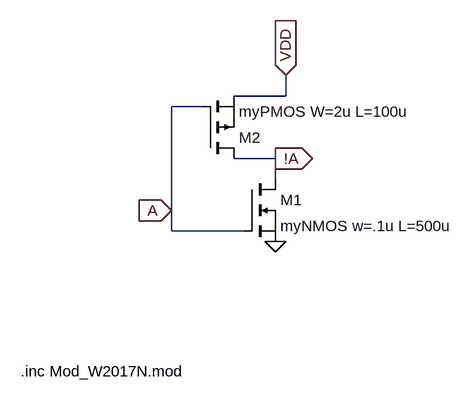
[diagram p0: schematic Gate_NOT_Slow.asc]
Gate_NOT_Slow.asc, the LTspice schematic file:
Version 4
SHEET 1 880 680
WIRE 64 -112 64 -144
WIRE 64 -112 -16 -112
WIRE -64 -96 -112 -96
WIRE 48 -16 -16 -16
WIRE 48 16 48 -16
WIRE -112 64 -112 -96
WIRE -112 96 -112 64
WIRE 0 96 -112 96
FLAG -112 64 A
IOPIN -112 64 In
FLAG 48 -16 !A
IOPIN 48 -16 Out
FLAG 64 -144 VDD
IOPIN 64 -144 In
FLAG 48 112 0
SYMBOL nmos 0 16 R0
SYMATTR InstName M1
SYMATTR Value myNMOS w=.1u L=500u
SYMBOL pmos -64 -16 M180
SYMATTR InstName M2
SYMATTR Value myPMOS W=2u L=100u
TEXT -344 312 Left 2 !.inc Mod_W2017N.mod

The netlist it stands for:
* Gate_NOT_Slow.asc
M1 !A A 0 0 myNMOS w=.1u L=500u
M2 !A A VDD VDD myPMOS W=2u L=100u
.model NMOS NMOS
.model PMOS PMOS
.lib standard.mos
.inc Mod_W2017N.mod
.backanno
.end